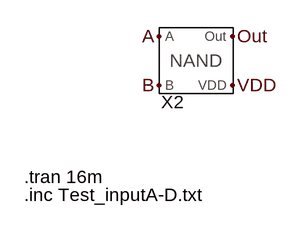
[diagram p0: schematic Test_NAND.asc]
Test_NAND.asc, the LTspice schematic file:
Version 4
SHEET 1 880 680
FLAG 224 112 Out
FLAG 128 112 A
FLAG 128 176 B
FLAG 224 176 VDD
SYMBOL Gate_NAND 176 144 R0
SYMATTR InstName X2
TEXT -48 296 Left 2 !.tran 16m
TEXT -48 320 Left 2 !.inc Test_inputA-D.txt

The netlist it stands for:
* Test_NAND.asc
XX2 A B Out VDD Gate_NAND  ; pins A B Out VDD
.tran 16m
.inc Test_inputA-D.txt
.backanno
.end